# Altium schematic sheet Sheet3.SchDoc
size A
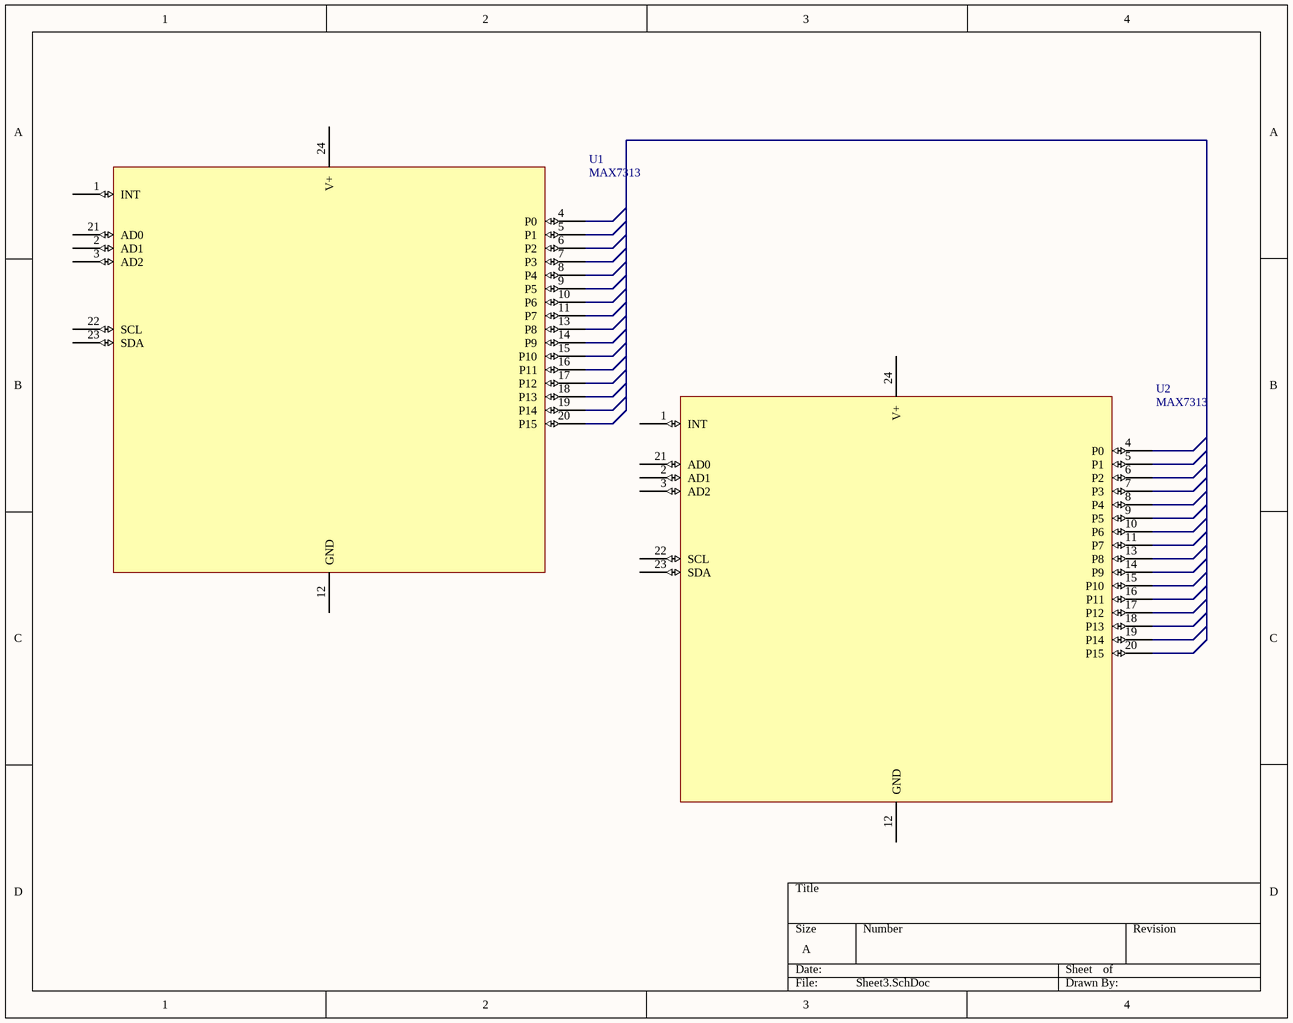
[diagram p0: Sheet3.SchDoc]

## Parts
U1  MAX7313  [QSOP24]
U2  MAX7313  [QSOP24]

## Nets

Not connected (* = marked no-connect by the designer): U1 1(INT) 2(AD1) 3(AD2) 4(P0) 5(P1) 6(P2) 7(P3) 8(P4) 9(P5) 10(P6) 11(P7) 12(GND) 13(P8) 14(P9) 15(P10) 16(P11) 17(P12) 18(P13) 19(P14) 20(P15) 21(AD0) 22(SCL) 23(SDA) 24(V+); U2 1(INT) 2(AD1) 3(AD2) 4(P0) 5(P1) 6(P2) 7(P3) 8(P4) 9(P5) 10(P6) 11(P7) 12(GND) 13(P8) 14(P9) 15(P10) 16(P11) 17(P12) 18(P13) 19(P14) 20(P15) 21(AD0) 22(SCL) 23(SDA) 24(V+)